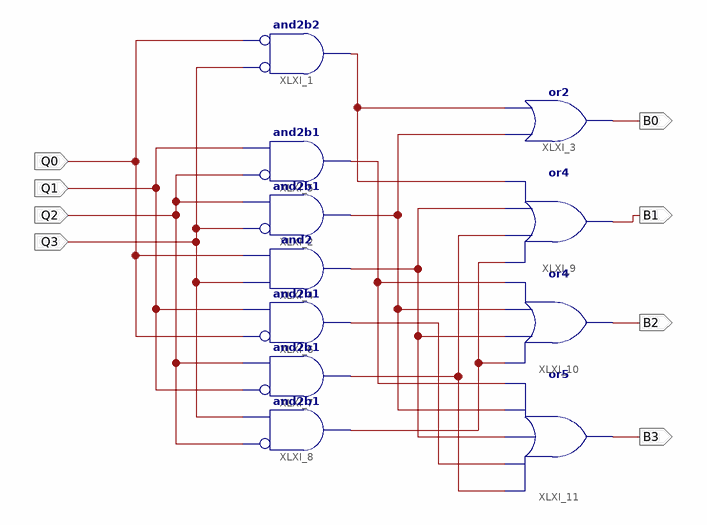
[diagram p0: schematic sheet 1]
// Xilinx ISE schematic dekoderJohnson.sch (spartan3e) as structural Verilog: 11 symbols, 8 ports
module dekoderJohnson (
  input  Q0,
  input  Q2,
  input  Q3,
  input  Q1,
  output B0,
  output B1,
  output B2,
  output B3
);

  wire XLXN_34, XLXN_35, XLXN_61, XLXN_62, XLXN_63, XLXN_64, XLXN_70;

  and XLXI_1 (XLXN_34, ~Q3, ~Q0);  // and2b2
  and XLXI_2 (XLXN_35, ~Q3, Q2);  // and2b1
  or XLXI_3 (B0, XLXN_35, XLXN_34);
  and XLXI_4 (XLXN_61, Q3, Q0);
  and XLXI_5 (XLXN_64, ~Q2, Q1);  // and2b1
  and XLXI_6 (XLXN_70, ~Q0, Q1);  // and2b1
  and XLXI_7 (XLXN_62, ~Q1, Q2);  // and2b1
  and XLXI_8 (XLXN_63, ~Q2, Q3);  // and2b1
  or XLXI_9 (B1, XLXN_63, XLXN_62, XLXN_61, XLXN_34);
  or XLXI_10 (B2, XLXN_63, XLXN_61, XLXN_35, XLXN_64);
  or XLXI_11 (B3, XLXN_62, XLXN_70, XLXN_61, XLXN_35, XLXN_64);
endmodule
